# Altium schematic sheet i2c_mux.SchDoc
size B; Address1: MILWAUKEE TOOL; Address2: 13135 W. Lisbon Rd.; Address3: Brookfield, WI 53005; SheetNumber: 1; SheetTotal: 1
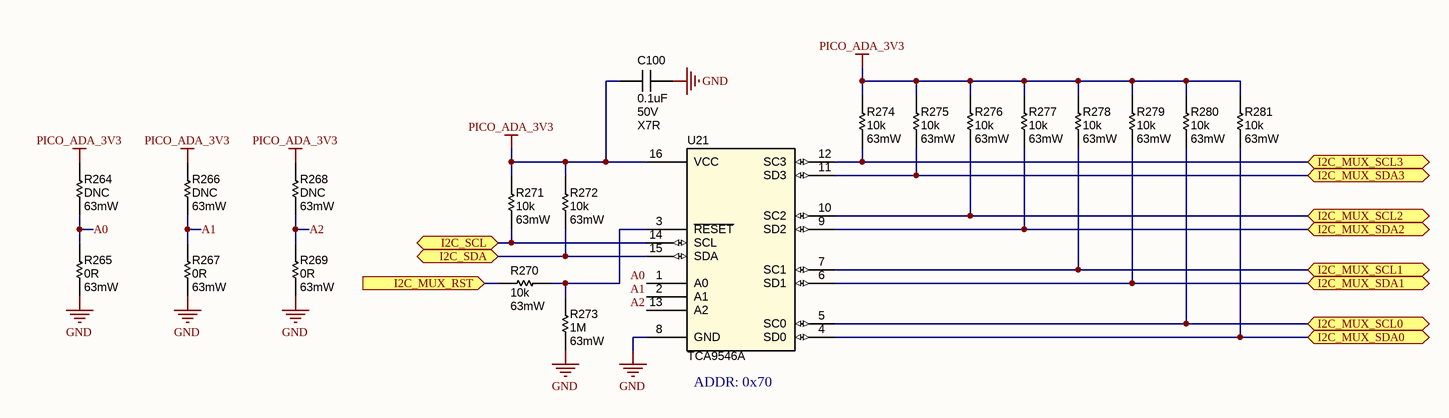
[diagram p0: i2c_mux.SchDoc]

## Parts
C100  0.1uF  Voltage Rating: 50V  Temp Coeff: X7R  [CAPC1005X06N]
R264  DNC  Wattage: 63mW  [RESC1005X04N]
R265  0R  Wattage: 63mW  [RESC1005X04N]
R266  DNC  Wattage: 63mW  [RESC1005X04N]
R267  0R  Wattage: 63mW  [RESC1005X04N]
R268  DNC  Wattage: 63mW  [RESC1005X04N]
R269  0R  Wattage: 63mW  [RESC1005X04N]
R270  10k  Wattage: 63mW  [RESC1005X04N]
R271  10k  Wattage: 63mW  [RESC1005X04N]
R272  10k  Wattage: 63mW  [RESC1005X04N]
R273  1M  Wattage: 63mW  [RESC1005X04N]
R274  10k  Wattage: 63mW  [RESC1005X04N]
R275  10k  Wattage: 63mW  [RESC1005X04N]
R276  10k  Wattage: 63mW  [RESC1005X04N]
R277  10k  Wattage: 63mW  [RESC1005X04N]
R278  10k  Wattage: 63mW  [RESC1005X04N]
R279  10k  Wattage: 63mW  [RESC1005X04N]
R280  10k  Wattage: 63mW  [RESC1005X04N]
R281  10k  Wattage: 63mW  [RESC1005X04N]
U21  TCA9546A  [SOP65P640X120-16N]

## Ports
I2C_MUX_RST (in), I2C_MUX_SCL0 (bidir), I2C_MUX_SCL1 (bidir), I2C_MUX_SCL2 (bidir), I2C_MUX_SCL3 (bidir), I2C_MUX_SDA0 (bidir), I2C_MUX_SDA1 (bidir), I2C_MUX_SDA2 (bidir), I2C_MUX_SDA3 (bidir), I2C_SCL (bidir), I2C_SDA (bidir)

## Nets
GND: C100.1 R265.1 R267.1 R269.1 R273.1 U21.8(GND)
PICO_ADA_3V3: C100.2 R264.2 R266.2 R268.2 R271.2 R272.2 R274.2 R275.2 R276.2 R277.2 R278.2 R279.2 R280.2 R281.2 U21.16(VCC)
A0: R264.1 R265.2 U21.1(A0)
A1: R266.1 R267.2 U21.2(A1)
A2: R268.1 R269.2 U21.13(A2)
I2C_MUX_RST: R270.1 ; port I2C_MUX_RST
I2C_MUX_SCL0: R280.1 U21.5(SC0) ; port I2C_MUX_SCL0
I2C_MUX_SCL1: R278.1 U21.7(SC1) ; port I2C_MUX_SCL1
I2C_MUX_SCL2: R276.1 U21.10(SC2) ; port I2C_MUX_SCL2
I2C_MUX_SCL3: R274.1 U21.12(SC3) ; port I2C_MUX_SCL3
I2C_MUX_SDA0: R281.1 U21.4(SD0) ; port I2C_MUX_SDA0
I2C_MUX_SDA1: R279.1 U21.6(SD1) ; port I2C_MUX_SDA1
I2C_MUX_SDA2: R277.1 U21.9(SD2) ; port I2C_MUX_SDA2
I2C_MUX_SDA3: R275.1 U21.11(SD3) ; port I2C_MUX_SDA3
I2C_SCL: R271.1 U21.14(SCL) ; port I2C_SCL
I2C_SDA: R272.1 U21.15(SDA) ; port I2C_SDA
NetR270_2: R270.2 R273.2 U21.3(~{RESET})

## Notes on the sheet
- (near U21) ADDR: 0x70
- Schematic Notes
- Schematic Revision History
- Title
- ALL CAPACITORS ARE CERAMIC, 0603, 50V, 10%, X7R UNLESS OTHERWISE STATED
- ALL RESISTORS ARE FILM, 0603, 1/10W, 5%, 200ppm/°C UNLESS OTHERWISE STATED
- Size:
- Date:
- B
- Number:
- Sheet
- Revision:
- of
- Drawn By:
- Brookfield, WI 53005
- File:
- Platform Base:
- Engineer:
- This Document is the property of MILWAUKEE TOOL and may not be reproduced, in any form, without the written premission of MILWAUKEE TOOL.

## Library data of the parts
C100 = CMP-004-0076: CAP CER SMD 0.1UF 50V X7R 0402; MFR3#: KGM05CR71H104KH; MFR#: GRM155R71H104KE14D; MFR: Murata Electronics; MFR4#: CL05B104KB54PNC; MFR2#: C1005X7R1H104K050BB; Tolerance: 10%; Populate: Yes; Temp Range: -55 / +125 C; Capacitor Type: Ceramic; Case Code (Imperial): 0402; Value: 0.1uF; MFR4: Samsung Electro-Mechanics; Design Item ID: CN/0.1uF/50V/X7R/10%/0402; Case Code (Metric): 1005; ComponentLink1URL: https://search.murata.co.jp/Ceramy/image/img/A01X/G101/ENG/GRM155R71H104KE14-01.pdf; MFR3: KYOCERA AVX; MFR2: TDK Corporation; ComponentLink1Description: Datasheet; RoHS Compliant: Yes; Part Status: Production
R264-R269 = CMP-025-0102: RES SMD 0 OHM JUMPER 1/16W 0402; MFR3#: CRCW04020000Z0ED; MFR: Stackpole Electronics Inc; MFR2#: AC0402JR-070RL; MFR4#: RS-02K000JT; MFR#: RMCF0402ZT0R00; Value: 0 ohm; Quality: AEC-Q200; Voltage Rating: 50V; Current: 1A; Temp Range: -55 / +155 C; Case Code (Metric): 1002; Case Code (Imperial): 0402; MFR2: YAGEO; Design Item ID: R/0.00/0.063W/JUMPER/0402; MFR4: FengHua; Resistor Type: Thick Film; ClassName: Fine_Pitch; MFR3: Vishay Dale; Tolerance: Jumper; REACH SVHC: Yes; RoHS Compliant: Yes
R270-R272 R274-R281 = CMP-025-0026: RES SMD 10K OHM 0.5% 1/16W 0402; MFR2#: RNCF0402DTE10K0; MFR#: ERA-2AED103X; MFR: Panasonic Electronic Components; Temp Range: -55 / +155 C; Voltage Rating: 50V; Temperature Coefficient: 25ppm/°C; Quality: AEC-Q200; MFR2: Stackpole Electronics Inc; RoHS Compliant: Yes; ComponentLink1Description: Datasheet; REACH SVHC: Yes; Value: 10k; Case Code (Imperial): 0402; Case Code (Metric): 1005; Tolerance: 0.5%; Resistor Type: Thick Film; Design Item ID: R/10.0K/0.063W/0.5%/0402; ComponentLink1URL: https://industrial.panasonic.com/cdbs/www-data/pdf/RDM0000/AOA0000C307.pdf
R273 = CMP-025-0173: RES SMD 1M OHM 1% 1/16W 0402; MFR#: RC0402FR-071ML; MFR: YAGEO; Value: 1M Ohm; Temp Range: -55 / +155 C; Temperature Coefficient: 100ppm/°C; Populate: Yes; Tolerance: 1%; ComponentLink1Description: Datasheet; ComponentLink1URL: https://yageogroup.com/content/datasheet/asset/file/PYU-RC_GROUP_51_ROHS_L; Resistor Type: Thick Film; Case Code (Imperial): 0402; Case Code (Metric): 1005; Design Item ID: R/1.0M/0.063W/1%/0402; RoHS Compliant: Yes; Part Status: Production
U21 = CMP-017-0074: IC BUS SWITCH 2 X 1:4 16TSSOP; MFR: Texas Instruments; MFR#: TCA9546APWR; Temp Range: -40 / +150 C; Value: TCA9546APWR; Current, Operating: 14uA; Voltage Range: 1.65V - 5.5V DC; Populate: Yes; Rth(j-c): 56.6 C/W; Rth(j-a): 122.3 C/W; Current, Quiescent: 1.3uA; ComponentLink1Description: Datasheet; REACH SVHC: Unaffected; ClassName: FinePitch; Case/Package: TSSOP16; Type: I2C Multiplexer; Part Status: Production; ComponentLink1URL: https://www.ti.com/general/docs/suppproductinfo.tsp?distId=10&gotoUrl=https%3A%2F%2Fwww.ti.com%2Flit%2Fgpn%2Ftca9546a; RoHS Compliant: Yes; Design Item ID: IC/SW/TCA9546APWR/TSSOP16; ComponentLink2URL: https://www.ti.com/product/TCA9546A#product-details; ComponentLink2Description: Product Page